# EAGLE design lpcprogger_mit_Fassung_V02 (EAGLE 5.00)
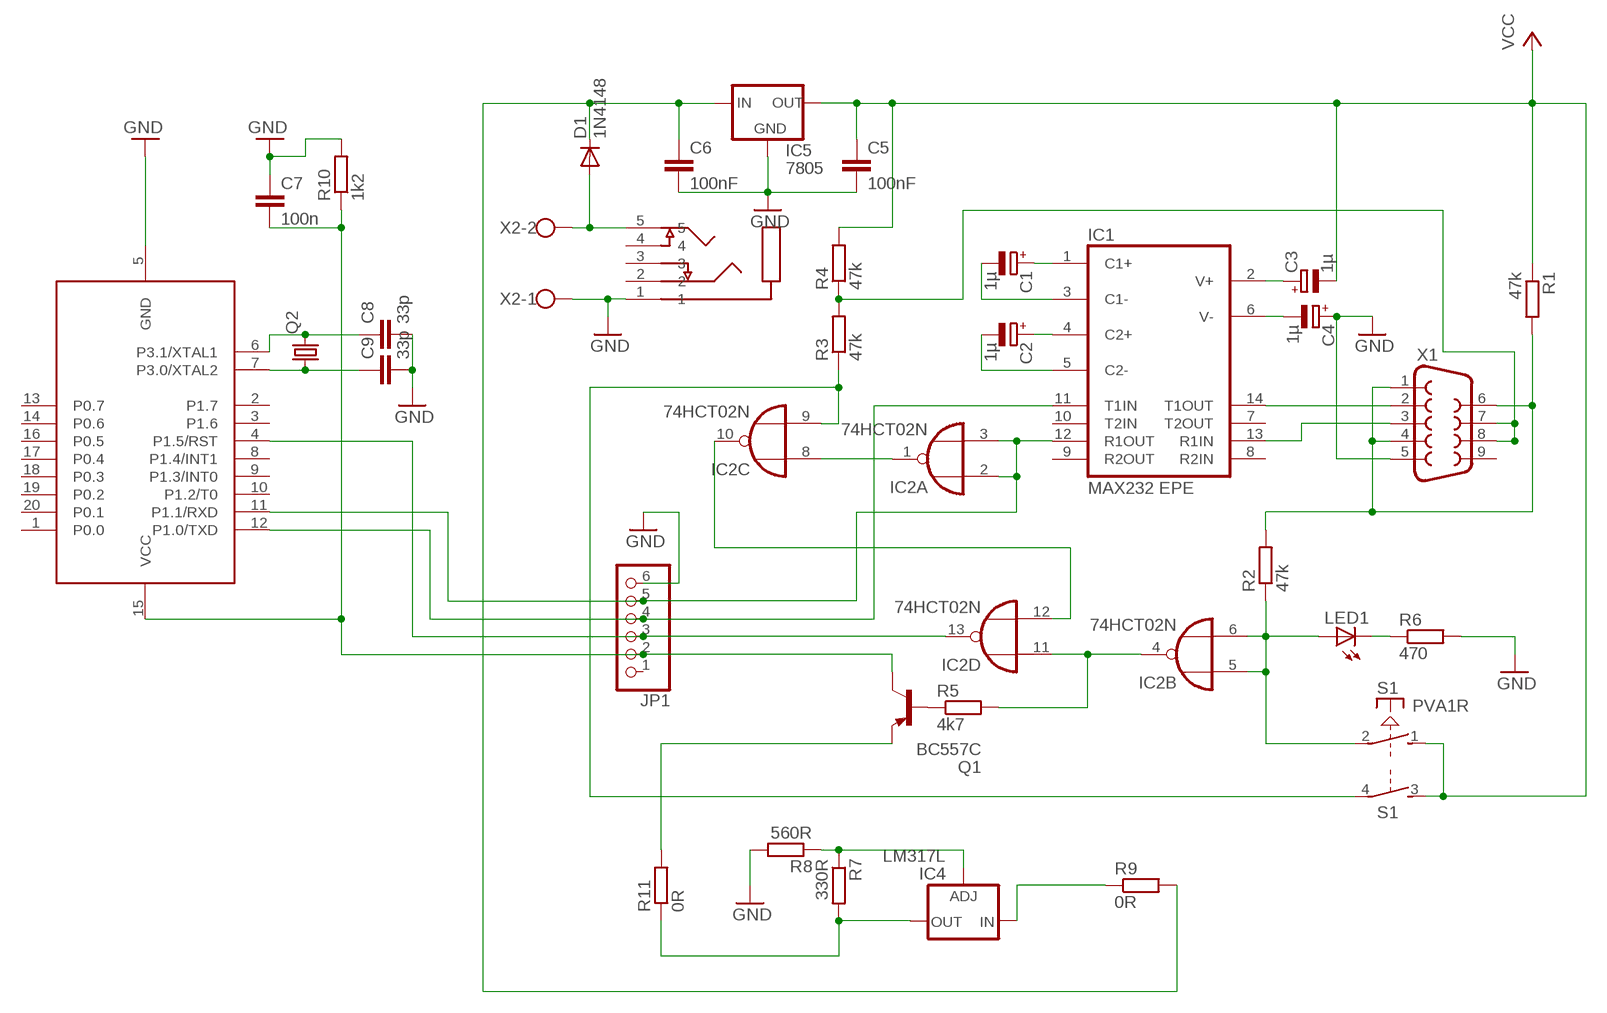
[diagram p0: schematic, sheet 1]

## Parts
C1  1µ  CPOL-EUE2.5-6  [E2,5-6]
C2  1µ  CPOL-EUE2.5-6  [E2,5-6]
C3  1µ  CPOL-EUE2.5-6  [E2,5-6]
C4  1µ  CPOL-EUE2.5-6  [E2,5-6]
C5  100nF  C-EU025-025X050  [C025-025X050]
C6  100nF  C-EU025-025X050  [C025-025X050]
C7  100n  C-EU050-024X044  [C050-024X044]
C8  33p  C-EU025-025X050  [C025-025X050]
C9  33p  C-EU025-025X050  [C025-025X050]
D1  1N4148  [DO35-10]
IC1  MAX232 EPE  MAX232  [DIL16]
IC2  74HCT02N  [DIL14]
IC4  LM317L  [317L]
IC5  7805  78XXS  [78XXS]
JP1  PINHD-1X6  [1X06]
LED1  LED3MM  [LED3MM]
Q1  BC557C  BC557  [TO92]
Q2  CRYSTALHC49S  [HC49/S]
R1  47k  R-EU_0207/10  [0207/10]
R2  47k  R-EU_0207/10  [0207/10]
R3  47k  R-EU_0207/10  [0207/10]
R4  47k  R-EU_0207/10  [0207/10]
R5  4k7  R-EU_0207/10  [0207/10]
R6  470  R-EU_0207/10  [0207/10]
R7  330R  R-EU_0207/7  [0207/7]
R8  560R  R-EU_0207/7  [0207/7]
R9  0R  R-EU_0207/10  [0207/10]
R10  1k2  R-EU_0204/7  [0204/7]
R11  0R  R-EU_0207/10  [0207/10]
S1  PVA1R  [PVA1R]
U1  89LPC922  [DIL20]
U$1  KLINKENBUCHSE3,5MMSTEREO  [KLINKE3,5MMSTEREO]
X1  F09H  [F09H]
X2  W237-02P  [W237-132]

## Nets
GND: C4.+ C5.2 C6.2 C7.1 C8.2 C9.2 IC5.GND JP1.6 R6.2 R8.2 R10.2 U1.5(GND) U$1.1 X1.5 X2.1
N$1: Q1.1(E) R11.2
N$2: IC1.14(T1OUT) X1.2
N$3: IC1.13(R1IN) X1.3
N$4: C1.+ IC1.1(C1+)
N$5: C1.- IC1.3(C1-)
N$6: C2.+ IC1.4(C2+)
N$7: C2.- IC1.5(C2-)
N$8: C3.+ IC1.2(V+)
N$9: C4.- IC1.6(V-)
N$11: IC2.5(B:I0) IC2.6(B:I1) LED1.A R2.1 S1.2(1:P)
N$12: IC2.4(B:O) IC2.11(D:I0) R5.2
N$13: C9.1 Q2.1 U1.7(P3.0/XTAL2)
N$14: IC2.1(A:O) IC2.8(C:I0)
N$15: R3.2 R4.1 X1.7 X1.8
N$16: IC2.9(C:I1) R3.1 S1.4(2:P)
N$17: IC2.10(C:O) IC2.12(D:I1)
N$18: C8.1 Q2.2 U1.6(P3.1/XTAL1)
N$19: LED1.K(C) R6.1
N$20: Q1.2(B) R5.1
N$21: IC4.3(IN) R9.1
N$24: R1.2 R2.2 X1.1 X1.4 X1.6
N$26: IC4.1(ADJ) R7.1 R8.1
N$27: IC4.2(OUT) R7.2 R11.1
N$28: D1.A U$1.5 X2.2
RST: IC2.13(D:O) JP1.3 U1.4(P1.5/RST)
RXD: IC1.12(R1OUT) IC2.2(A:I0) IC2.3(A:I1) JP1.5 U1.11(P1.1/RXD)
TXD: IC1.11(T1IN) JP1.4 U1.12(P1.0/TXD)
VCC: C3.- C5.1 IC5.OUT R1.1 R4.2 S1.1(1:S) S1.3(2:S)
VCCMC: C7.2 JP1.2 Q1.3(C) R10.1 U1.15(VCC)
VDD: C6.1 D1.C IC5.IN R9.2
Unconnected: IC1.7(T2OUT) IC1.8(R2IN) IC1.9(R2OUT) IC1.10(T2IN) JP1.1 U1.1(P0.0) U1.2(P1.7) U1.3(P1.6) U1.8(P1.4/INT1) U1.9(P1.3/INT0) U1.10(P1.2/T0) U1.13(P0.7) U1.14(P0.6) U1.16(P0.5) U1.17(P0.4) U1.18(P0.3) U1.19(P0.2) U1.20(P0.1) U$1.2 U$1.3 U$1.4 X1.9

## Power pins joined to a net without a drawn wire
GND: IC1.15(GND) IC2.7(P:GND)
VCC: IC1.16(VCC) IC2.14(P:VCC)

## Library data of the parts
C1-C4 = rcl:CPOL-EU: POLARIZED CAPACITOR, European symbol
C5-C9 = rcl:C-EU: CAPACITOR, European symbol
D1 = diode:1N4148: DIODE high speed (Philips)
IC1 = maxim:MAX232: RS232 TRANSEIVER
IC2 = 74xx-eu:74*02: Quad 2-input NOR gate
IC4 = v-reg:LM317L: VOLTAGE REGULATOR
IC5 = v-reg:78XXS: VOLTAGE REGULATOR
JP1 = pinhead:PINHD-1X6: PIN HEADER
LED1 = led:LED: LED OSRAM: - CHIPLED LG R971, LG N971, LY N971, LG Q971, LY Q971, LO R971, LY R971 LH N974, LH R974 LS Q976, LO Q976, LY Q976 LO Q996 - Hyper CHIPLED LW Q18S LB Q993, LB Q99A, LB R99A - SideLED LS A670, LO A670, LY A670, LG A670, LP A670 LB A673, LV A673, LT A673, LW A673 LH A674 LY A675 LS A676, LA A676, LO A676, LY A676, LW A676 LS A679, LY A679, LG A679 - Hyper Micro SIDELED® LS Y876, LA Y876, LO Y876, LY Y876 LT Y87S - SmartLED LW L88C, LW L88S LB L89C, LB L89S, LG L890 LS L89K, LO L89K, LY L89K LS L896, LA L896, LO L896, LY L896 - TOPLED LS T670, LO T670, LY T670, LG T670, LP T670 LSG T670, LSP T670, LSY T670, LOP T670, LYG T670 LG T671, LOG T671, LSG T671 LB T673, LV T673, LT T673, LW T673 LH T674 LS T676, LA T676, LO T676, LY T676, LB T676, LH T676, LSB T676, LW T676 LB T67C, LV T67C, LT T67C, LS T67K, LO T67K, LY T67K, LW E67C LS E67B, LA E67B, LO E67B, LY E67B, LB E67C, LV E67C, LT E67C LW T67C LS T679, LY T679, LG T679 LS T770, LO T770, LY T770, LG T770, LP T770 LB T773, LV T773, LT T773, LW T773 LH T774 LS E675, LA E675, LY E675, LS T675 LS T776, LA T776, LO T776, LY T776, LB T776 LHGB T686 LT T68C, LB T68C - Hyper Mini TOPLED® LB M676 - Mini TOPLED Santana® LG M470 LS M47K, LO M47K, LY M47K Source: http://www.osram.convergy.de - LUMILED® LXK2-PW12-R00, LXK2-PW12-S00, LXK2-PW14-U00, LXK2-PW14-V00 LXK2-PM12-R00, LXK2-PM12-S00, LXK2-PM14-U00 LXK2-PE12-Q00, LXK2-PE12-R00, LXK2-PE12-S00, LXK2-PE14-T00, LXK2-PE14-U00 LXK2-PB12-K00, LXK2-PB12-L00, LXK2-PB12-M00, LXK2-PB14-N00, LXK2-PB14-P00, LXK2-PB14-Q00 LXK2-PR12-L00, LXK2-PR12-M00, LXK2-PR14-Q00, LXK2-PR14-R00 LXK2-PD12-Q00, LXK2-PD12-R00, LXK2-PD12-S00 LXK2-PH12-R00, LXK2-PH12-S00 LXK2-PL12-P00, LXK2-PL12-Q00, LXK2-PL12-R00 Source: www.luxeon.com
Q1 = transistor-pnp:BC557: PNP Transistor
Q2 = crystal:CRYSTAL: CRYSTAL
R1-R11 = rcl:R-EU_: RESISTOR, European symbol
S1 = switch-misc:PVA1R: ITT SWITCH
U1 = micro-philips:89LPC922
U$1 = kubi:KLINKENBUCHSE3,5MMSTEREO
X1 = con-subd:F09: SUB-D
X2 = con-wago-508:W237-02P: WAGO SREW CLAMP

## Board
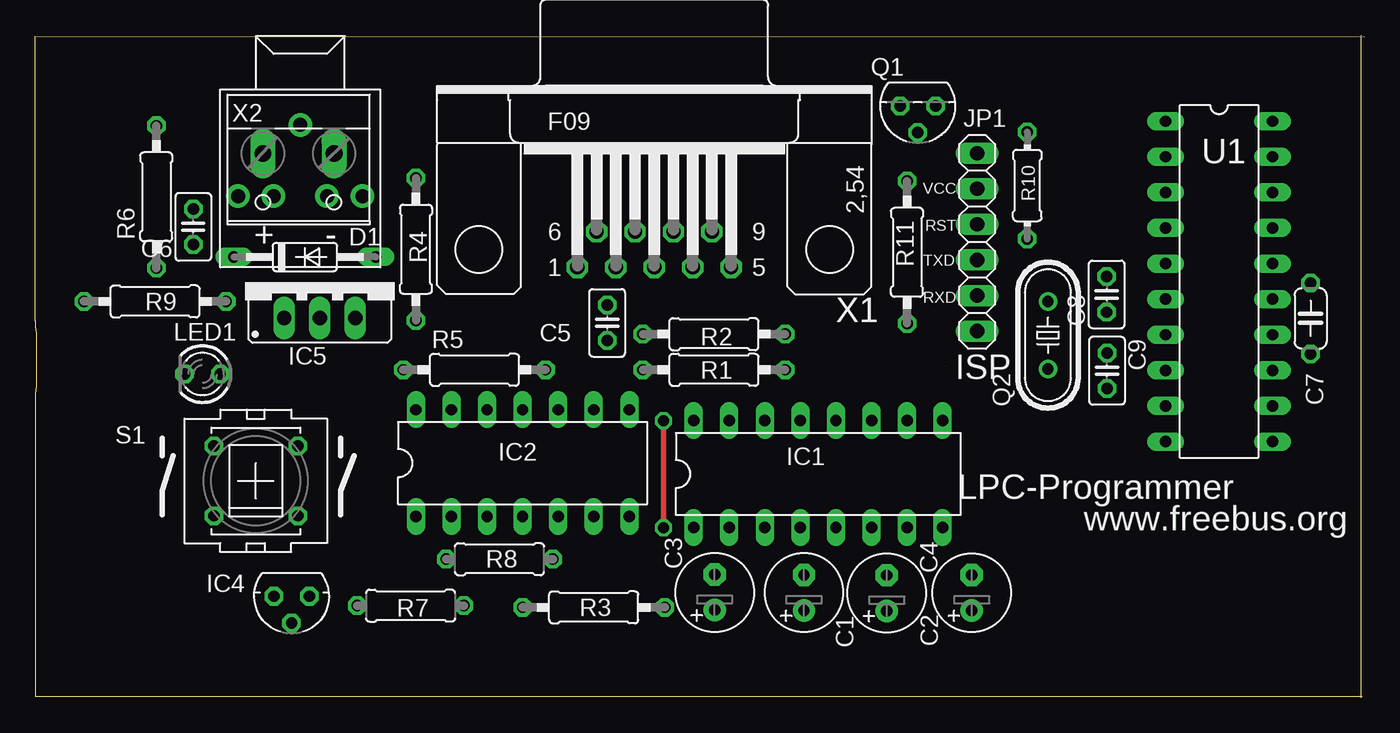
[diagram p1: board, top side]
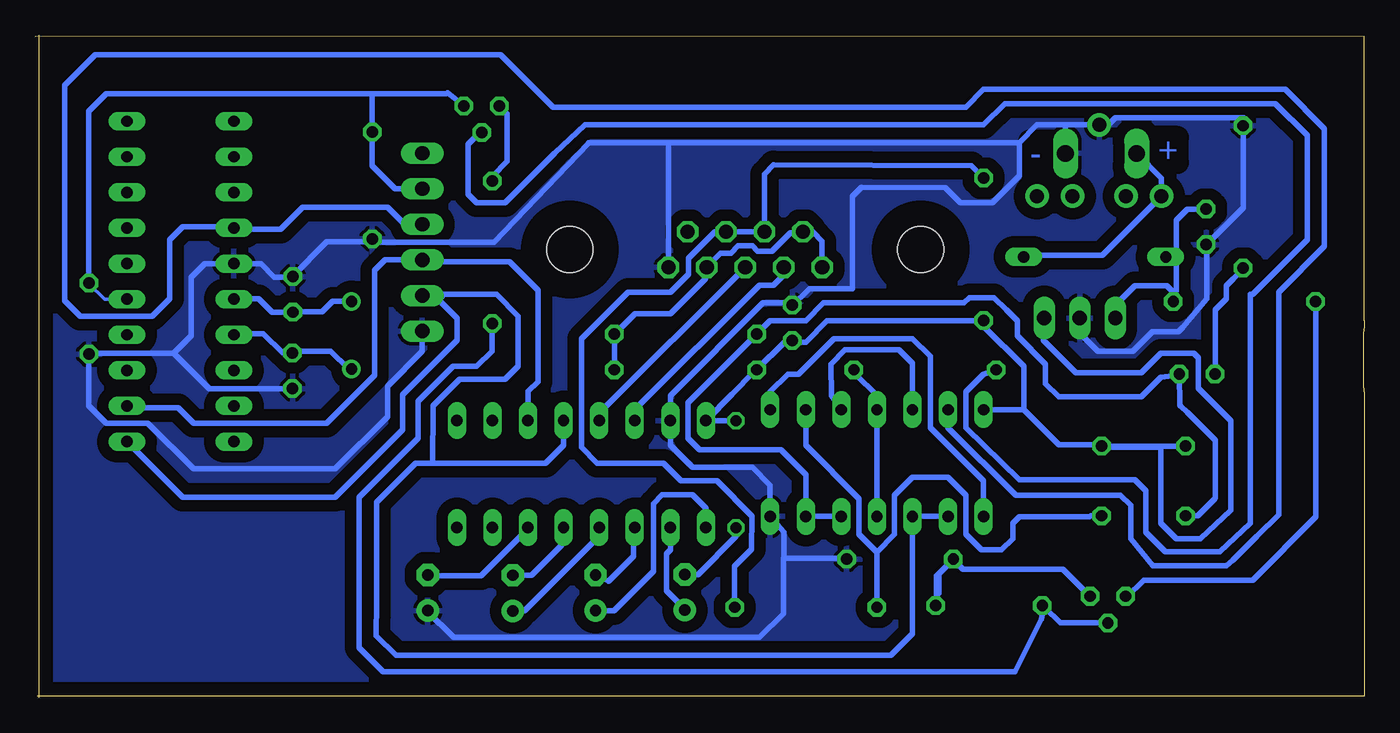
[diagram p2: board, bottom side, seen from below]

Size 94.91 x 47.29 mm. Coordinates in mm from the lower left corner, seen from the top.
Outline: 94.91,47.19 0.01,47.19 0.01,26.91 0,26.44 0.08,26.05 0.08,22.23 0,21.69 0.01,21.06 0.01,0.11 94.76,0.11
Outline: 94.64,47.3 94.64,0
Copper layers (1*16): Top 0.035mm / dielectric 1.5mm / Bottom 0.035mm
Design rules "default": minimum track width 10mil, minimum drill 24mil, track to track 8mil, track to pad 8mil, pad to pad 8mil, via to via 8mil, smd to smd 8mil, copper to edge 40mil, drill to drill 8mil, minimum pad ring 10mil, minimum via ring 8mil, stop-mask expansion 4mil, vias tented up to drill 0mil, thermal gap 10mil

### Footprints (pad centres in the part's own frame; a part is rotated, then mirrored left to right if it is on the bottom)
E2,5-6 = drill 0.813 pad 1.6 round: + -1.27,0 | drill 0.813 pad 1.6 octagon: - 1.27,0
C025-025X050 = drill 0.813 octagon: 1 -1.27,0; 2 1.27,0
C050-024X044 = drill 0.813 octagon: 1 -2.54,0; 2 2.54,0
DO35-10 = drill 0.813 long: A 5.08,0; C -5.08,0
DIL16 = drill 0.813 long: 1 -8.89,-3.81; 2 -6.35,-3.81; 3 -3.81,-3.81; 4 -1.27,-3.81; 5 1.27,-3.81; 6 3.81,-3.81; 7 6.35,-3.81; 8 8.89,-3.81; 9 8.89,3.81; 10 6.35,3.81; 11 3.81,3.81; 12 1.27,3.81; 13 -1.27,3.81; 14 -3.81,3.81; 15 -6.35,3.81; 16 -8.89,3.81
DIL14 = drill 0.813 long: 1 -7.62,-3.81; 2 -5.08,-3.81; 3 -2.54,-3.81; 4 0,-3.81; 5 2.54,-3.81; 6 5.08,-3.81; 7 7.62,-3.81; 8 7.62,3.81; 9 5.08,3.81; 10 2.54,3.81; 11 0,3.81; 12 -2.54,3.81; 13 -5.08,3.81; 14 -7.62,3.81
317L = drill 0.813 octagon: 1 -1.27,0; 2 0,1.905; 3 1.27,0
78XXS = drill 1.016 long: GND 0,-2.54; IN -2.54,-2.54; OUT 2.54,-2.54
1X06 = drill 1.016 long: 1 -6.35,0; 2 -3.81,0; 3 -1.27,0; 4 1.27,0; 5 3.81,0; 6 6.35,0
LED3MM = drill 0.813 octagon: A -1.27,0; K 1.27,0
TO92 = drill 0.813 octagon: 1 1.27,0; 2 0,1.905; 3 -1.27,0
HC49/S = drill 0.813 round: 1 -2.413,0; 2 2.413,0
0207/10 = drill 0.813 octagon: 1 -5.08,0; 2 5.08,0
0207/7 = drill 0.813 octagon: 1 -3.81,0; 2 3.81,0
0204/7 = drill 0.813 octagon: 1 -3.81,0; 2 3.81,0
PVA1R = drill 0.813 octagon: 1 -2.997,2.489; 2 -2.997,-2.489; 3 2.997,2.489; 4 2.997,-2.489
DIL20 = drill 0.813 long: 1 -11.43,-3.81; 2 -8.89,-3.81; 3 -6.35,-3.81; 4 -3.81,-3.81; 5 -1.27,-3.81; 6 1.27,-3.81; 7 3.81,-3.81; 8 6.35,-3.81; 9 8.89,-3.81; 10 11.43,-3.81; 11 11.43,3.81; 12 8.89,3.81; 13 6.35,3.81; 14 3.81,3.81; 15 1.27,3.81; 16 -1.27,3.81; 17 -3.81,3.81; 18 -6.35,3.81; 19 -8.89,3.81; 20 -11.43,3.81
KLINKE3,5MMSTEREO = drill 1 pad 1.676 round: 1 2.54,5.715; 2 7.62,10.16; 3 7.62,7.62; 4 7.62,3.81; 5 7.62,1.27
F09H = drill 1.016 octagon: 1 -5.486,-1.27; 2 -2.743,-1.27; 3 0,-1.27; 4 2.743,-1.27; 5 5.486,-1.27; 6 -4.115,1.27; 7 -1.372,1.27; 8 1.372,1.27; 9 4.115,1.27 | hole 3.302: -12.522,0; 12.522,0
W237-132 = drill 1.194 long: 1 -2.54,-0.635; 2 2.54,-0.635

### Placement (x,y rotation side)
C1  54.9,7.5 90 top
C2  60.81,7.47 90 top
C3  48.51,7.52 90 top
C4  66.87,7.49 90 top
C5  40.85,26.76 90 top
C6  11.3,33.6 270 top
C7  91.07,27.07 90 top
C8  76.51,28.78 90 top
C9  76.53,23.34 270 top
D1  19.27,31.45 0 top
IC1  55.91,15.97 0 top
IC2  34.81,16.74 0 top
IC4  18.32,7.24 180 top
IC5  20.33,29.64 0 top
JP1  67.26,32.52 270 top
LED1  11.95,23.09 180 top
Q1  63.02,42.24 180 top
Q2  72.31,25.88 90 top
R1  48.47,23.41 0 top
R2  48.47,25.95 0 top
R3  39.89,6.45 0 top
R4  27.19,32.01 270 top
R5  31.37,23.41 0 top
R6  8.66,35.74 90 top
R7  26.81,6.57 180 top
R8  33.16,9.89 0 top
R9  8.57,28.28 0 top
R10  70.84,36.56 270 top
R11  62.26,31.79 90 top
S1  15.76,15.47 0 top
U1  84.53,29.71 270 top
U$1  13.22,43.41 270 top
X1  44.21,31.98 0 top
X2  18.81,38.21 180 top

### Tracks (layer width: path | path; a pad name or v marks a point on that pad's centre or on a via)
GND
  Bottom 0.406: 41.5,9.96 41.44,9.96 41.44,11.82 IC2.7 42.43,15.16 43.7,16.43 47.98,16.43 49.56,18.02 IC1.15 49.56,21.55 42.94,28.17 41,28.17 C5.2 40.91,27.97 40.91,27.92 39.64,29.19 36.57,29.19 36.57,35.8 35.92,36.44 29.92,36.41 28.84,35.32 26.58,35.32 24.65,37.25 24.65,39.61 | 41.5,9.96 41.5,5.99 43.18,4.31 61.23,4.31 65.04,4.31 66.95,6.22 C4.+ | 24.65,39.61 49.8,39.61 | 49.8,39.61 55.38,39.61 55.38,39.57 62.13,32.52 68.04,32.52 | 19.57,40.88 18.3,40.88 17.79,41.38 8.61,41.38 8.67,41.14 R6.2 8.66,34.96 11.26,32.36 | 19.57,40.88 U$1.1 | 24.65,39.61 23.38,40.88 21.35,40.88 | 19.57,40.88 21.35,40.88 | X1.5 49.69,39.5 49.8,39.61 | 21.35,40.88 X2.1 | R8.2 37.04,9.96 41.5,9.96 | 11.26,32.36 11.26,28.47 12.97,26.45 13.28,26.14 15.14,26.14 16.54,24.74 19.03,24.74 20.28,25.98 20.28,27.07 20.3,27.07 IC5.GND | 11.26,32.36 11.28,32.33 C6.2 | 70.84,32.53 70.84,32.52 | R10.2 70.84,32.73 70.84,32.53 | 68.04,32.52 | R10.2 70.81,32.67 70.68,32.67 70.68,32.98 | R10.2 70.87,32.7 70.68,32.52 68.04,32.52 | 85,24.58 83.75,25.83 83.75,30.03 82.79,30.98 U1.5 80.38,30.96 78.77,30.96 77.84,30.03 76.6,30.03 76.57,30.05 | 85,24.58 91.22,24.58 | 76.57,30.05 C8.2 | 70.84,32.53 74.09,32.53 76.57,30.05 | JP1.6 67.26,24.74 69.75,22.25 69.75,20.07 73.49,16.34 83.6,16.34 86.86,19.6 89.82,19.6 91.07,20.85 91.07,24.42 91.22,24.58 | 91.22,24.58 91.17,24.53 C7.1 | C9.2 82.48,22.07 85,24.58
  pour Bottom (isolate 0.813): -2.9,50.41 -2.44,50.87 95.58,50.87 95.58,-2.02 -2.28,-2.02
N$1
  Bottom 0.406: R11.2 62.26,37.21 61.19,38.27 61.19,41.69 61.74,42.24 Q1.1
N$2
  Bottom 0.406: IC1.14 52.1,20.54 43.19,29.45 42.18,29.45 41.41,30.21 41.41,30.72 X1.2
N$3
  Bottom 0.406: IC1.13 54.64,20.28 X1.3
N$4
  Bottom 0.406: IC1.1 47.02,13.52 47.97,14.47 50.15,14.47 50.77,13.85 50.77,9.02 53.57,6.22 54.35,6.22 54.82,6.23 C1.+
N$5
  Bottom 0.406: C1.- 53.98,8.3 52.17,10.11 52.17,11.98 52.02,12.13 52.04,12.16 IC1.3
N$6
  Bottom 0.406: C2.+ 59.97,6.2 54.66,11.51 54.66,12.29 54.64,12.27 IC1.4
N$7
  Bottom 0.406: C2.- 59.45,8.74 57.31,10.89 57.31,12.13 57.28,12.16 IC1.5
N$8
  Bottom 0.406: IC1.2 49.56,10.55 49.84,10.27 49.84,7.62 48.51,6.3 C3.+
N$9
  Bottom 0.406: IC1.6 59.72,12.06 63.06,8.71 66.8,8.71 66.87,8.64 | 66.87,8.64 66.95,8.56 | 66.87,8.64 C4.-
N$11
  Bottom 0.406: IC2.5 IC2.6 39.89,15.93 41.67,17.7 47.49,17.7 48.29,18.51 48.29,21.05 R2.1 42.43,26.91 39.89,26.91 38.62,28.17 28.58,28.17 28.21,28.55 26.44,28.55 25.57,27.69 | S1.2 11.9,12.99 10.68,14.21 10.63,14.31 10.63,18.36 11.57,19.29 12.19,19.91 12.66,20.38 13.12,20.82 13.17,20.87 LED1.A 13.44,23.02 14.52,22.87 15.92,21.47 21.83,21.47 22.77,22.4 22.77,23.8 24.79,25.83 24.79,26.91 25.57,27.69 | 25.57,27.69
N$12
  Bottom 0.406: IC2.4 IC2.11 34.81,21.57 36.33,23.09 R5.2
N$13
  Bottom 0.406: Q2.1 72.52,23.46 73.8,24.74 76.6,24.74 76.53,24.67 C9.1 77.24,24.61 78.62,25.98 80.95,25.98 80.88,25.91 U1.7
N$14
  Bottom 0.406: IC2.8 42.43,21.83 41.16,23.09 40.4,23.09 37.86,25.63 32.27,25.63 31,24.37 31,19.29 27.19,15.47 IC2.1
N$15
  Bottom 0.406: R3.2 44.97,9.38 43.77,10.58 43.73,12.96 46.24,15.47 48.78,15.47 50.05,16.74 54.79,16.74 55.91,17.86 55.91,25.62 52.59,28.94 49.54,28.94 48.27,30.21 48.27,31.35 46.37,33.26 X1.8 X1.7 42.84,37.36 42.18,38.02 28.06,37.96 R4.1
N$16
  Bottom 0.406: IC2.9 39.89,18.02 36.08,14.21 36.08,11.66 34.81,10.39 | 34.81,10.39 33.54,11.66 33.54,14.46 32.27,15.73 29.73,15.73 28.46,14.46 28.46,11.66 27.35,10.55 25.91,10.55 25.1,11.36 25.1,12.45 24.63,12.91 19.66,12.91 19.52,12.99 S1.4 | 34.81,10.39 R3.1
N$17
  Bottom 0.406: IC2.10 38.06,21.54 38.1,23.8 37.1,24.83 33.23,24.83 32.27,23.87 IC2.12
N$18
  Bottom 0.406: Q2.2 73.67,28.29 74.42,27.54 76.44,27.54 76.47,27.51 C8.1 77.97,27.51 78.93,28.47 80.64,28.47 80.67,28.45 U1.6
N$19
  Bottom 0.406: R6.1 9.37,29.89 9.86,29.4 9.86,28.47 10.63,27.69 10.63,23.18 10.68,23.13 LED1.K
N$20
  Bottom 0.406: R5.1 27.19,23.09 28.46,21.83 28.46,19.29 24.63,15.56 16.39,15.56 15.61,14.78 15.61,11.82 14.21,10.42 10.32,10.42 8.14,12.45 8.14,28.78 7.99,28.78 4.1,32.67 4.1,40.14 6.36,42.4 25.67,42.4 27.19,40.88 55.65,40.88 57.83,38.84 57.82,38.84 61.35,35.32 63.37,35.32 64,35.94 64,39.52 63.18,40.33 Q1.2
N$21
  Bottom 0.406: R9.1 3.49,12.9 7.99,8.4 15.77,8.4 17.01,7.16 17.05,7.2 IC4.3
N$24
  Bottom 0.406: R1.2 R2.2 52.08,27.41 49.54,27.41 47.05,29.9 47.05,30.92 46.95,30.92 X1.4 47,30.72 45.99,31.73 45.22,31.73 44.72,32.24 43.7,32.24 43.32,31.86 42.3,31.86 40.98,33.18 X1.6 | X1.1 38.72,32.59 39.38,33.26 X1.6 | X1.6 40.14,33.26
N$26
  Bottom 0.406: R7.1 30.5,7.47 30.39,7.47 30.39,8.85 R8.1 | R8.1 30.55,8.69 30.55,7.31 | IC4.1 21.52,9.18 28.68,9.18 29.39,9.89 | 29.39,9.89 29.46,9.96 | 29.39,9.89 R8.1
N$27  (1 unrouted)
  Bottom 0.406: 23.08,5.6 24.95,1.87 70.06,1.87 71.77,3.58 71.77,14.31 67.57,18.51 67.57,18.67 67.57,21.16 | 23.08,5.6 22.92,6.33 R7.2 22.8,6.41 21.73,5.34 IC4.2 | 23.08,5.6 | 62.28,26.91 62.59,26.68 R11.1 62.36,26.6 62.28,26.91 | 64.93,23.65 | 64.93,23.65 63.37,23.65 62.28,24.74 62.28,26.91 | 67.57,21.16 67.26,21.47 | 67.57,21.16 67.42,21.31 | 64.93,23.65 65.08,23.65 67.57,21.16
N$28
  Bottom 0.406: X2.2 14.49,37.07 U$1.5 18.7,31.58 24.32,31.58 24.32,31.48 D1.A
RST
  Bottom 0.406: IC2.13 29.73,19.29 24.9,14.46 17.41,14.46 16.69,13.74 16.69,11.33 15.11,9.44 9.86,9.44 9.39,9.79 7.68,11.51 6.12,13.07 6.12,28.94 2.85,32.2 2.85,40.61 5.66,43.41 27.19,43.41 28.46,42.15 57.92,42.15 61.67,45.9 90.6,45.9 92.78,43.72 92.78,28.31 91.69,27.23 86.55,27.23 85.31,28.47 85.31,32.67 84.38,33.6 80.64,33.6 U1.4 80.64,33.45 78.93,33.45 | JP1.3 67.26,33.76 68.51,33.76 69.75,35 75.82,35 77.37,33.45 78.93,33.45 | 78.93,33.45 78.77,33.45
RXD
  Bottom 0.406: IC2.2 IC2.3 32.27,4.56 33.79,3.04 69.15,3.04 70.58,4.41 70.53,6.85 70.53,13.97 67.75,16.74 66.52,16.74 | IC1.12 57.18,18.02 58.45,16.74 66.52,16.74 | 66.52,16.74 66.48,20.69 66.48,20.85 64.62,22.71 61.35,22.71 60.42,23.65 60.42,27.23 61.97,28.78 65.86,28.78 65.86,28.63 66.17,28.63 | JP1.5 67.18,28.63 66.17,28.63 | U1.11 84.37,14.31 80.33,14.31 | 80.33,14.31 80.02,14.31 | 66.17,28.63 66.17,28.47 64.77,27.07 64.77,25.51 68.66,21.62 68.66,19.14 73.49,14.31 80.33,14.31
TXD
  Bottom 0.406: 66.01,31.19 JP1.4 | 66.01,31.19 65.87,31.19 | JP1.4 68.01,31.27 68.51,31.27 | JP1.4 67.29,31.27 69.91,31.27 70.68,30.49 70.68,23.02 74.11,19.6 83.6,19.6 84.69,20.69 88.42,20.69 88.55,20.83 | 88.55,20.83 88.58,20.85 | 88.55,20.83 U1.12 | IC1.11 59.72,21.86 59.02,22.56 59.02,29.09 61.04,31.12 66.02,31.12 66.01,31.12 66.01,31.19
VCC  (via drill 0.8)
  Top 0.406: v44.86,19.76 v44.86,12.13
  Bottom 0.406: 18.3,18.02 18.35,17.96 S1.3 18.88,18.05 21.83,18.05 24.32,20.54 | S1.1 18.25,17.96 18.3,18.02 | 27.19,26.91 27.28,26.91 | 27.28,26.91 38.37,26.91 39.89,25.38 40.65,25.38 | 27.19,26.91 R4.2 | 27.28,26.91 | 40.65,25.38 40.91,25.38 40.91,25.43 C5.1 40.74,25.38 40.65,25.38 | 40.65,25.38 41.41,25.38 R1.1 43.57,23.25 45.15,21.67 IC1.16 47.04,19.76 v44.86,19.76 | 18.3,18.02 18.02,17.89 14.52,17.89 14.52,17.58 14.52,12.45 13.43,11.36 11.72,11.36 9.54,13.38 9.54,19.76 11.88,22.09 11.88,24.27 12.19,24.58 14.52,24.58 15.92,23.18 20.59,23.18 21.52,24.11 22.3,24.89 22.92,25.51 22.92,27.07 22.9,27.07 IC5.OUT | 27.19,26.91 27.19,26.52 24.32,23.65 24.32,20.54 | 24.32,20.54 24.34,20.55 IC2.14 | C3.- 47.58,8.79 44.86,11.51 v44.86,12.13
VCCMC
  Bottom 0.254: C7.2 91.06,29.56 91.07,29.56 89.95,28.45 U1.15
  Bottom 0.406: 67.26,36.41 JP1.2 69.21,36.33 70.84,37.96 70.84,40.45 70.87,40.42 R10.1 | R10.1 70.87,40.32 | 79.09,43.09 89.82,43.09 91.06,41.85 91.06,29.72 | 79.09,43.09 78.93,43.09 | 91.06,29.72 91.07,29.72 91.06,29.72 | 91.06,29.72 C7.2 | Q1.3 65.47,43.17 65.55,43.09 70.84,43.09 | 70.84,43.09 79.09,43.09 | R10.1 70.84,43.09
VDD
  Bottom 0.406: R9.2 13.74,28.9 13.74,29.03 | 13.74,29.03 13.43,29.03 13.43,31.43 | 13.43,31.43 13.43,34.07 12.66,34.85 11.27,34.85 | 11.27,34.85 11.26,34.85 | 11.27,34.85 C6.1 | D1.C 13.43,31.45 13.43,31.43 | 13.74,29.03 14.11,29.4 16.39,29.4 17.79,28 IC5.IN

### Text on the board
Bottom: + | -
tPlace: + | -
tNames: VCC | RST | TXD | RXD | ISP | LPC-Programmer | www.freebus.org
tValues: GND